# Altium schematic sheet Card-Shuffler.SchDoc
size 431 x 279 mm; Conception: Conception?; Titre: Projet-Yawgmoth; Modification: Modification?; Organization: ORGANIZATION; Address1: ADDRESS 1; Address2: ADDRESS 2; Address3: ADDRESS 3; Address4: ADDRESS 4; Revision: -; SheetNumber: 1; SheetTotal: 1; ENG_APP_DATE: --/--/--; DSN_APP_DATE: --/--/--; CHK_APP_DATE: --/--/--
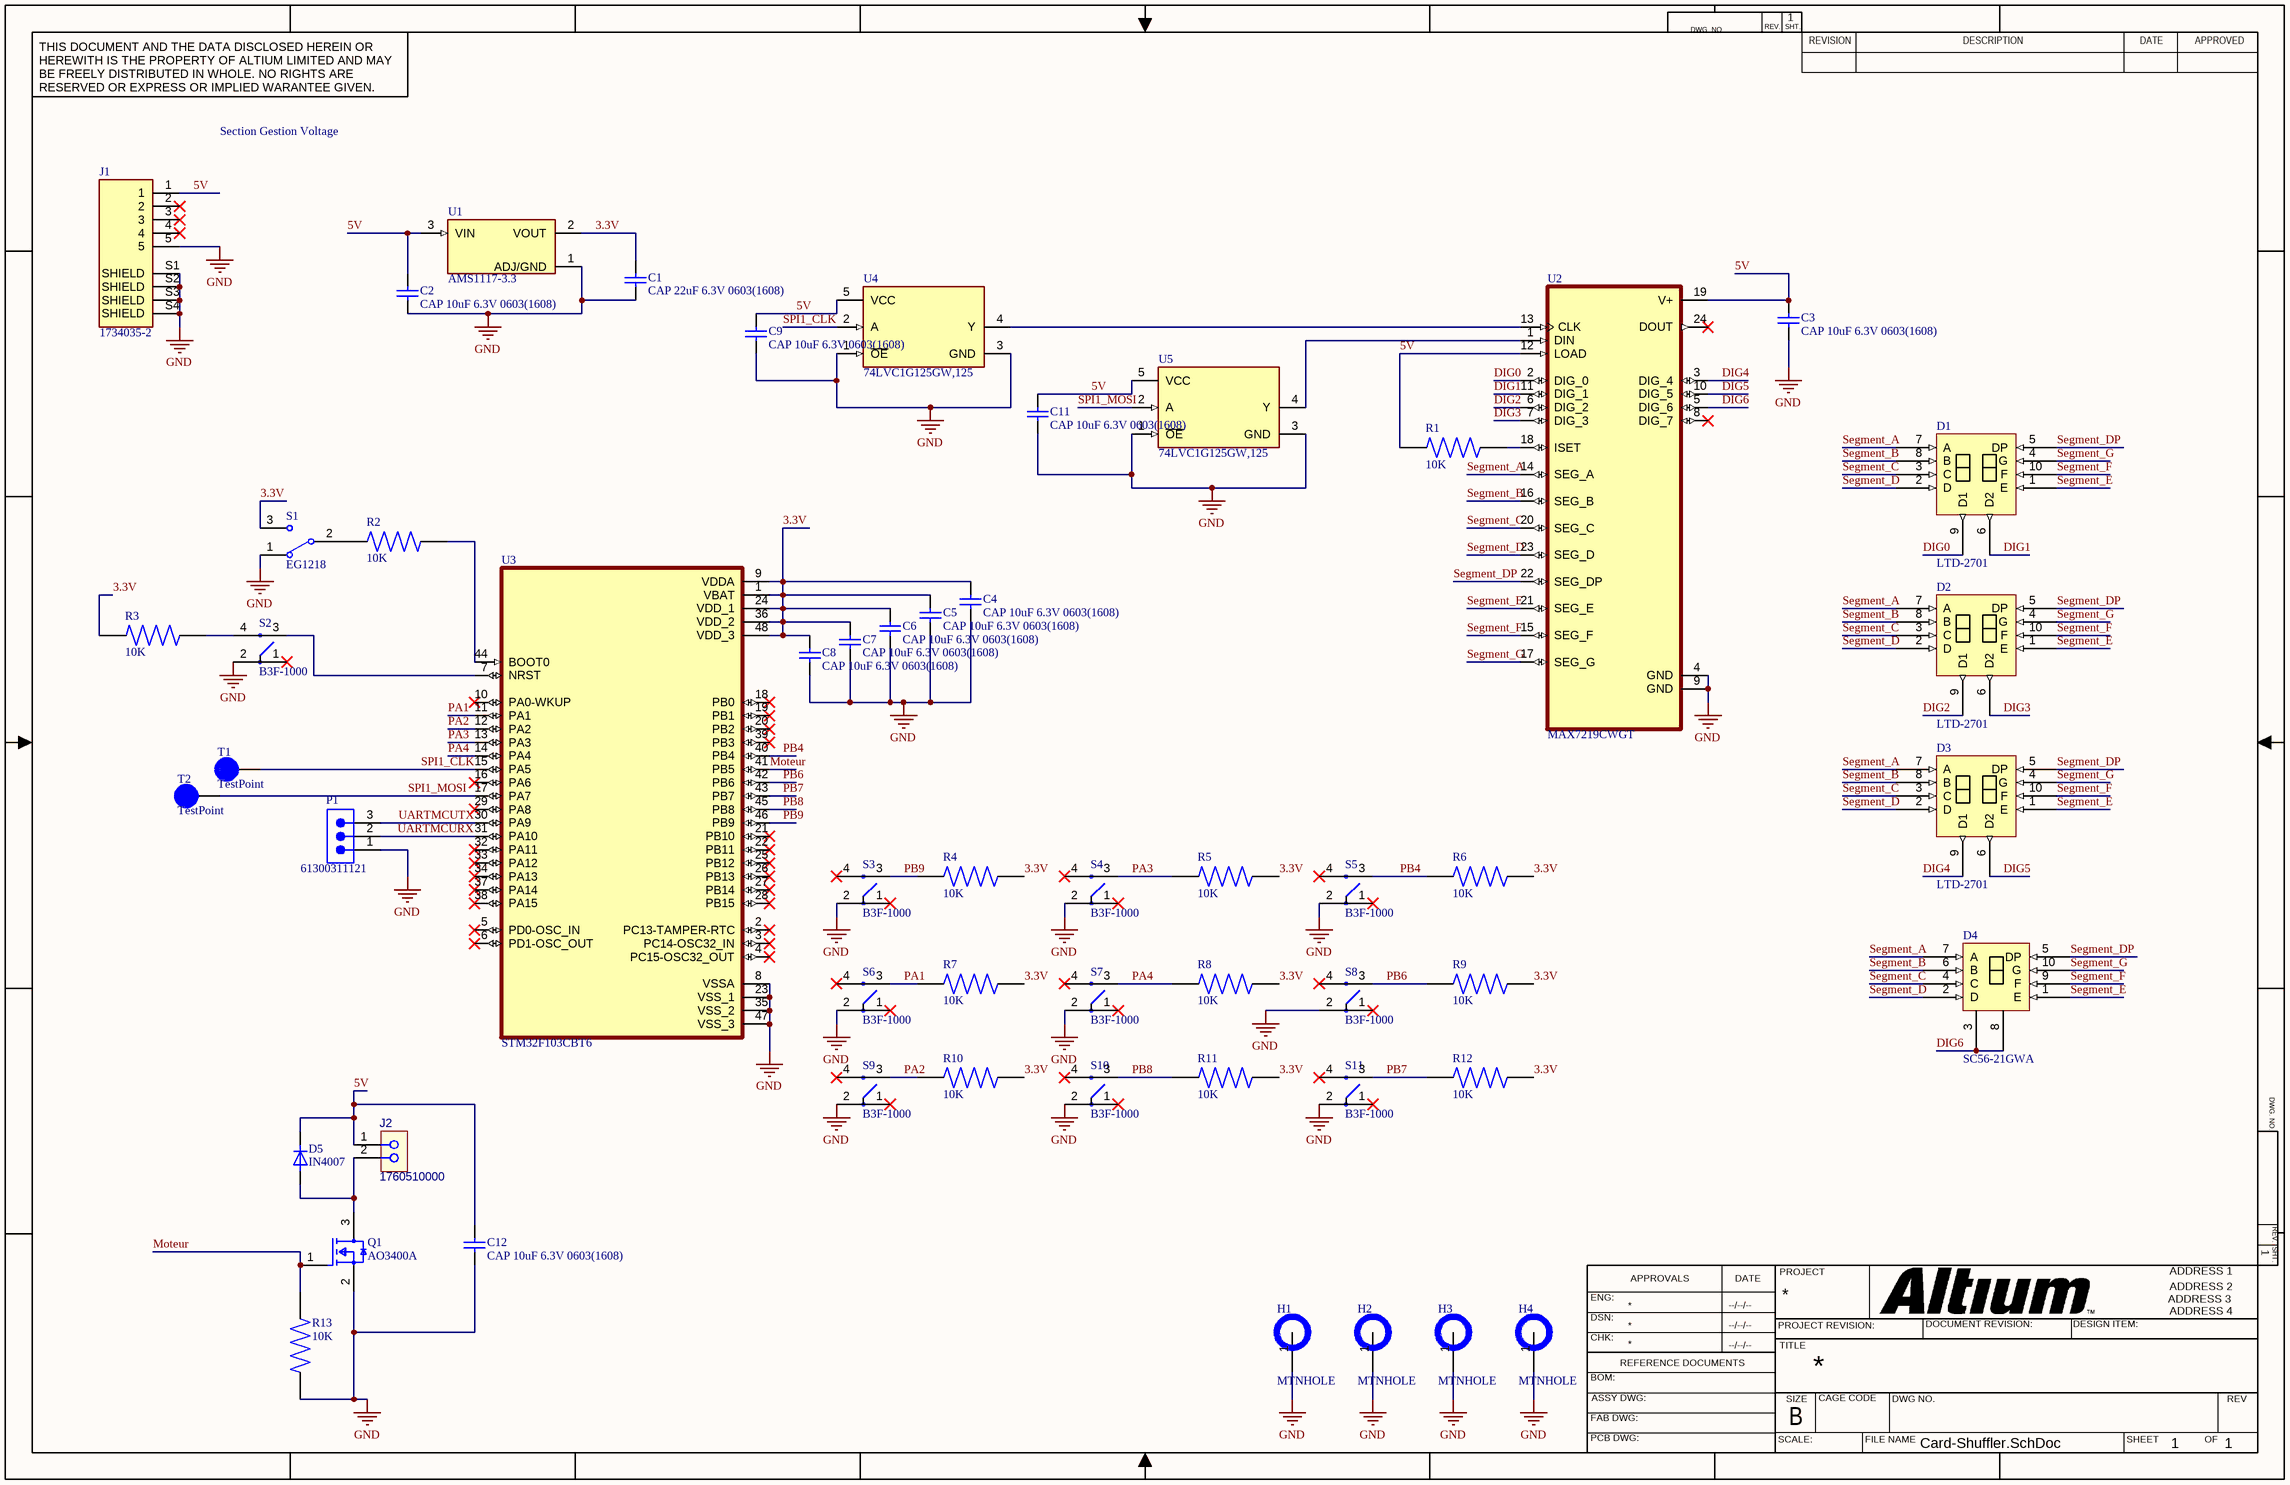
[diagram p0: Card-Shuffler.SchDoc]

## Parts
C1  CAP 22uF 6.3V 0603(1608)  [CAPC0603(1608)100_M]
C2  CAP 10uF 6.3V 0603(1608)  [CAPC0603(1608)100_M]
C3  CAP 10uF 6.3V 0603(1608)  [CAPC0603(1608)100_M]
C4  CAP 10uF 6.3V 0603(1608)  [CAPC0603(1608)100_M]
C5  CAP 10uF 6.3V 0603(1608)  [CAPC0603(1608)100_M]
C6  CAP 10uF 6.3V 0603(1608)  [CAPC0603(1608)100_M]
C7  CAP 10uF 6.3V 0603(1608)  [CAPC0603(1608)100_M]
C8  CAP 10uF 6.3V 0603(1608)  [CAPC0603(1608)100_M]
C9  CAP 10uF 6.3V 0603(1608)  [CAPC0603(1608)100_M]
C11  CAP 10uF 6.3V 0603(1608)  [CAPC0603(1608)100_M]
C12  CAP 10uF 6.3V 0603(1608)  [CAPC0603(1608)100_M]
D1  LTD-2701  [LTD-701JD]
D2  LTD-2701  [LTD-701JD]
D3  LTD-2701  [LTD-701JD]
D4  SC56-21GWA  [SC56-21GWA]
D5  IN4007  [DIOAD1070W78L470D235P]  (no BOM)
H1  MTNHOLE  [MTHOLE1_LAB4]  (no BOM)
H2  MTNHOLE  [MTHOLE1_LAB4]  (no BOM)
H3  MTNHOLE  [MTHOLE1_LAB4]  (no BOM)
H4  MTNHOLE  [MTHOLE1_LAB4]  (no BOM)
J1  1734035-2  [CONN_1734035-2]
J2  1760510000  [CONN_TERM_BLOCK_2POS_5mm_Model1]
P1  61300311121  [CONN_HDR_3POS_100MILS_TH]
Q1  AO3400A  [FP-SOT23-MFG]
R1  10K  [RES_ERJU03F1503V]
R2  10K  [RES_ERJU03F1503V]
R3  10K  [RES_ERJU03F1503V]
R4  10K  [RES_ERJU03F1503V]
R5  10K  [RES_ERJU03F1503V]
R6  10K  [RES_ERJU03F1503V]
R7  10K  [RES_ERJU03F1503V]
R8  10K  [RES_ERJU03F1503V]
R9  10K  [RES_ERJU03F1503V]
R10  10K  [RES_ERJU03F1503V]
R11  10K  [RES_ERJU03F1503V]
R12  10K  [RES_ERJU03F1503V]
R13  10K  [RES_ERJU03F1503V]
S1  EG1218  [ESWI-EG1218_V]
S2  B3F-1000  [SW_B3F-1000]
S3  B3F-1000  [SW_B3F-1000]
S4  B3F-1000  [SW_B3F-1000]
S5  B3F-1000  [SW_B3F-1000]
S6  B3F-1000  [SW_B3F-1000]
S7  B3F-1000  [SW_B3F-1000]
S8  B3F-1000  [SW_B3F-1000]
S9  B3F-1000  [SW_B3F-1000]
S10  B3F-1000  [SW_B3F-1000]
S11  B3F-1000  [SW_B3F-1000]
T1  TestPoint  [Testpoint]
T2  TestPoint  [Testpoint]
U1  AMS1117-3.3  [SOT229P700X180-4N]
U2  MAX7219CWGT  [SOIC127P1032X265-24N]
U3  STM32F103CBT6  [QFP50P900X900X160-48N]
U4  74LVC1G125GW,125  [FP-SOT353-1-IPC_A]
U5  74LVC1G125GW,125  [FP-SOT353-1-IPC_A]

## Nets
GND: C1.1 C2.1 C3.1 C4.1 C5.1 C6.1 C7.1 C8.1 C9.2 C11.1 C12.1 H1.1 H2.1 H3.1 H4.1 J1.5 J1.S1(SHIELD) J1.S2(SHIELD) J1.S3(SHIELD) J1.S4(SHIELD) P1.1 Q1.2(S) R13.1 S1.1 S2.2 S3.2 S4.2 S5.2 S6.2 S7.2 S8.2 S9.2 S10.2 S11.2 U1.1(ADJ/GND) U2.4(GND) U2.9(GND) U3.8(VSSA) U3.23(VSS_1) U3.35(VSS_2) U3.47(VSS_3) U4.1(~{OE}) U4.3(GND) U5.1(~{OE}) U5.3(GND)
3.3V: C1.2 C4.2 C5.2 C6.2 C7.2 C8.2 R3.1 R4.2 R5.2 R6.2 R7.2 R8.2 R9.2 R10.2 R11.2 R12.2 S1.3 U1.2(VOUT) U3.1(VBAT) U3.9(VDDA) U3.24(VDD_1) U3.36(VDD_2) U3.48(VDD_3)
5V: C2.2 C3.2 C9.1 C11.2 C12.2 D5.C J1.1 J2.1 R1.1 U1.3(VIN) U2.12(LOAD) U2.19(V+) U4.5(VCC) U5.5(VCC)
DIG0: D1.9(D1) U2.2(DIG_0)
DIG1: D1.6(D2) U2.11(DIG_1)
DIG2: D2.9(D1) U2.6(DIG_2)
DIG3: D2.6(D2) U2.7(DIG_3)
DIG4: D3.9(D1) U2.3(DIG_4)
DIG5: D3.6(D2) U2.10(DIG_5)
DIG6: D4.3 D4.8 U2.5(DIG_6)
Moteur: Q1.1(G) R13.2 U3.41(PB5)
PA1: R7.1 S6.3 U3.11(PA1)
PA2: R10.1 S9.3 U3.12(PA2)
PA3: R5.1 S4.3 U3.13(PA3)
PA4: R8.1 S7.3 U3.14(PA4)
PB4: R6.1 S5.3 U3.40(PB4)
PB6: R9.1 S8.3 U3.42(PB6)
PB7: R12.1 S11.3 U3.43(PB7)
PB8: R11.1 S10.3 U3.45(PB8)
PB9: R4.1 S3.3 U3.46(PB9)
Segment_A: D1.7(A) D2.7(A) D3.7(A) D4.7(A) U2.14(SEG_A)
Segment_B: D1.8(B) D2.8(B) D3.8(B) D4.6(B) U2.16(SEG_B)
Segment_C: D1.3(C) D2.3(C) D3.3(C) D4.4(C) U2.20(SEG_C)
Segment_D: D1.2(D) D2.2(D) D3.2(D) D4.2(D) U2.23(SEG_D)
Segment_DP: D1.5(DP) D2.5(DP) D3.5(DP) D4.5(DP) U2.22(SEG_DP)
Segment_E: D1.1(E) D2.1(E) D3.1(E) D4.1(E) U2.21(SEG_E)
Segment_F: D1.10(F) D2.10(F) D3.10(F) D4.9(F) U2.15(SEG_F)
Segment_G: D1.4(G) D2.4(G) D3.4(G) D4.10(G) U2.17(SEG_G)
SPI1_CLK: T1.1 U3.15(PA5) U4.2(A)
SPI1_MOSI: T2.1 U3.17(PA7) U5.2(A)
UARTMCURX: P1.2 U3.31(PA10)
UARTMCUTX: P1.3 U3.30(PA9)
NetD5_A: D5.A J2.2 Q1.3(D)
NetR1_2: R1.2 U2.18(ISET)
NetR2_1: R2.1 S1.2(COM)
NetR2_2: R2.2 U3.44(BOOT0)
NetR3_2: R3.2 S2.4
NetS2_3: S2.3 U3.7(NRST)
NetU2_1: U2.1(DIN) U5.4(Y)
NetU2_13: U2.13(CLK) U4.4(Y)

Not connected (* = marked no-connect by the designer): J1 2* 3* 4*; S2 1*; S3 1* 4*; S4 1* 4*; S5 1* 4*; S6 1* 4*; S7 1* 4*; S8 1* 4*; S9 1* 4*; S10 1* 4*; S11 1* 4*; U2 8(DIG_7)* 24(DOUT)*; U3 2(PC13-TAMPER-RTC)* 3(PC14-OSC32_IN)* 4(PC15-OSC32_OUT)* 5(PD0-OSC_IN)* 6(PD1-OSC_OUT)* 10(PA0-WKUP)* 16(PA6)* 18(PB0)* 19(PB1)* 20(PB2)* 21(PB10)* 22(PB11)* 25(PB12)* 26(PB13)* 27(PB14)* 28(PB15)* 29(PA8)* 32(PA11)* 33(PA12)* 34(PA13)* 37(PA14)* 38(PA15)* 39(PB3)*

## Notes on the sheet
- Section Gestion Voltage
- DWG. NO.
- REV.
- SHT.
- THIS DOCUMENT AND THE DATA DISCLOSED HEREIN OR HEREWITH IS THE PROPERTY OF ALTIUM LIMITED AND MAY BE FREELY DISTRIBUTED IN WHOLE. NO RIGHTS ARE RESERVED OR EXPRESS OR IMPLIED WARANTEE GIVEN.
- REVISION
- DESCRIPTION
- DATE
- APPROVED
- ENG:
- APPROVALS
- PROJECT
- DSN:
- CHK:
- REFERENCE DOCUMENTS
- PROJECT REVISION:
- TITLE
- DOCUMENT REVISION:
- DESIGN ITEM:
- BOM:
- FAB DWG:
- PCB DWG:
- ASSY DWG:
- SCALE:
- SIZE
- B
- CAGE CODE
- FILE NAME
- DWG NO.
- SHEET
- OF
- REV

## Library data of the parts
C1 = CMP-1035-02796-1: CAP 22uF 6.3V ±10% 0603 (1608 Metric) Thickness 1mm SMD; Case-EIA: 0603; Tolerance: Â±10%; Value: 10uF; Case-Metric: 1608; Technology: SMT; Rated Voltage: 6.3 V; Max Thickness: 1 mm
C2-C9 C11 C12 = CMP-1035-02796-1: CAP 10uF 6.3V ±10% 0603 (1608 Metric) Thickness 1mm SMD; Case-EIA: 0603; Tolerance: Â±10%; Case-Metric: 1608; Value: 10uF; Technology: SMT; Rated Voltage: 6.3 V; Max Thickness: 1 mm
D1-D3 = LTD-2701: Afficheur 7-segments double; Supplier 1: Future Electronics; Supplier Part Number 1: LTD-2701G
D4 = SC56-21GWA: Afficheur 7-Segment; Supplier 1: DigiKey; Supplier Part Number 1: 754-1704-5-ND
D5 = IN4007: Diode Standard 1000 V 1A Through Hole DO-204AL (DO-41); MF: Vishay Semiconductor; SnapEDA_Link: https://www.snapeda.com/parts/IN4007/Vishay/view-part/?ref=snap; Package: DO-41 Vishay Semiconductor; Value: *; MP: IN4007; Check_prices: https://www.snapeda.com/parts/IN4007/Vishay/view-part/?ref=eda
J1 = 1734035-2: CONNECTOR, RECEPTACLE, MINI-USB, 1 PORT, SERIES B, RIGHT ANGLE | TE Connectivity 1734035-2; Number_of_Positions: 5; Centerline_Pitch: .8 mm[.031 in]; SnapEDA_Link: https://www.snapeda.com/parts/1734035-2/TE+Connectivity+AMP+Connectors/view-part/?ref=snap; Product_Type: Connector; Package: None; Value: *; MF: TE Connectivity; MP: 1734035-2; EU_RoHS_Compliance: Compliant; Check_prices: https://www.snapeda.com/parts/1734035-2/TE+Connectivity+AMP+Connectors/view-part/?ref=eda; Supplier 1: Avnet; Supplier Part Number 1: 1734035-2
J2 = CONN_TERM_BLOCK_2POS_5mm_MODEL2: CONN TERM BLOCK 2POS 5mm pitch; Manufacturer 1: Phoenix Contact; Manufacturer Part Number 1: 1890963; CEGEP: CONWECO0003; Manufacturer2: Weidmüller; Manufacturer2_PN: 1760510000; Supplier 1: Digi-Key; Supplier Part Number 1: 281-1882-ND; Mounting Technology: TH
P1 = CONN_HEADER_3POS: Header 3pins single row, TH; Manufacturer 1: Würth Elektronik; Manufacturer Part Number 1: 61300311121; Mounting Technology: TH; Supplier 1: Digi-Key; Supplier Part Number 1: 732-5316-ND
Q1 = CMP-83955-000006-1: MOSFET N-CH 30V 5.7A SOT23; Input Capacitance: 630pF; Number of Elements: 1; Rds On Max: 26.5mR; Max Power Dissipation: 1.4W; Gate to Source Voltage (Vgs): 12V; Min Operating Temperature: -55°C; Lead Free: Lead Free; Number of Pins: 3; Drain to Source Voltage (Vdss): 30V; Case/Package: SOT-23; Mount: Surface Mount; Continuous Drain Current (ID): 5.7A; Radiation Hardening: No; Packaging: Tape and Reel; Max Operating Temperature: 150°C; Power Dissipation: 1.4W
R1-R13 = ERJU03F1503V: 0201 anti-sulfurated resistor 0603 Anti-Sulfurated; MF: Panasonic; MP: ERJ-U03F1503V; SnapEDA_Link: https://www.snapeda.com/parts/ERJ-U03F1503V/Panasonic/view-part/?ref=snap; Package: 1608-2 Panasonic; Value: *; Check_prices: https://www.snapeda.com/parts/ERJ-U03F1503V/Panasonic/view-part/?ref=eda; Supplier 1: Avnet; Supplier Part Number 1: RC0603FR-1020KL
S1 = CMP-1696-00002-1: Slide Switch, 500 V, -20 to 70 degC, 3-Pin THD, RoHS; Case\Package: SOT-23-5; Output Current: 150 mA; Nominal Output Voltage: 3.3 V; Max Power Dissipation: 250 mW; Min Input Voltage: 4.3 V; Outputs: 1; Max Input Voltage: 8 V; Dropout Voltage: 300 mV; PackageDescription: 3-Pin Through Hole Device, Body 11.6 x 4 mm, Pitch 2.5 mm; ComponentLink1URL: http://www.e-switch.ch/en/; RoHSCompliant: true; Length: 3 mm; ComponentLink1Description: Manufacturer URL; Power Rating: 250 mW; Mount: Surface Mount; Max Operating Temperature: 85 degC; REACH SVHC: No SVHC; Radiation Hardening: No; Height: 1.3 mm; Pins: 5; Max Ouput Current: 150 mA; Output Voltage: 3.3 V; Width: 1.8 mm; Package Quantity: 3000; ComponentLink2URL: https://www.e-switch.com/system/asset/product_line/data_sheet/119/EG.pdf; Min Operating Temperature: -40 degC; ComponentLink2Description: Datasheet; DatasheetVersion: Oct-15; PackageReference: EG1218; Packaging: Tape and Reel
S2-S11 = B3F-1000: Switch Tactile N.O. SPST Flat Round Button PC Pins 0.05A 24VDC 1000000Cycles 0.98N Thru-Hole Bag; MF: Omron; MP: B3F1000; SnapEDA_Link: https://www.snapeda.com/parts/B3F1000/Omron/view-part/?ref=snap; Package: None; Value: *; Check_prices: https://www.snapeda.com/parts/B3F1000/Omron/view-part/?ref=eda; Supplier 1: Avnet; Supplier Part Number 1: B3F1000
U1 = AMS1117-3.3: Linear Voltage Regulator IC Positive Fixed 1 Output 1A SOT-223-3L; MF: UMW; SnapEDA_Link: https://www.snapeda.com/parts/AMS1117-3.3/UMW/view-part/?ref=snap; Package: SOT-223-3L UMW; Value: *; MP: AMS1117-3.3; Check_prices: https://www.snapeda.com/parts/AMS1117-3.3/UMW/view-part/?ref=eda; Supplier 1: DigiKey; Supplier Part Number 1: 5272-AMS1117-3.3SCT-ND
U2 = MAX7219CWGT: IC DRVR 7 SEGMNT 8 DIGIT 24SOIC; MF: Analog Devices; MP: MAX7219CWG+; SnapEDA_Link: https://www.snapeda.com/parts/MAX7219CWG+/Analog+Devices/view-part/?ref=snap; Package: SOIC-24 Maxim; Value: *; Check_prices: https://www.snapeda.com/parts/MAX7219CWG+/Analog+Devices/view-part/?ref=eda; Supplier 1: DigiKey; Supplier Part Number 1: MAX7219CWG+TCT-ND
U3 = STM32F103CBT6: ARMÂ® CortexÂ®-M3 STM32F1 Microcontroller IC 32-Bit Single-Core 72MHz 128KB (128K x 8) FLASH; MF: STMicroelectronics; SnapEDA_Link: https://www.snapeda.com/parts/STM32F103CBT6/STMicroelectronics/view-part/?ref=snap; Package: LQFP-48 STMicroelectronics; Value: *; MP: STM32F103CBT6; Check_prices: https://www.snapeda.com/parts/STM32F103CBT6/STMicroelectronics/view-part/?ref=eda; Supplier 1: Arrow Electronics; Supplier Part Number 1: STM32F103CBT6
U4 U5 = CMP-14347-000004-1: IC BUF NON-INVERT 5.5V 5TSSOP